# Altium schematic sheet Main.SchDoc
size A3; SheetNumber: 1; SheetTotal: 5
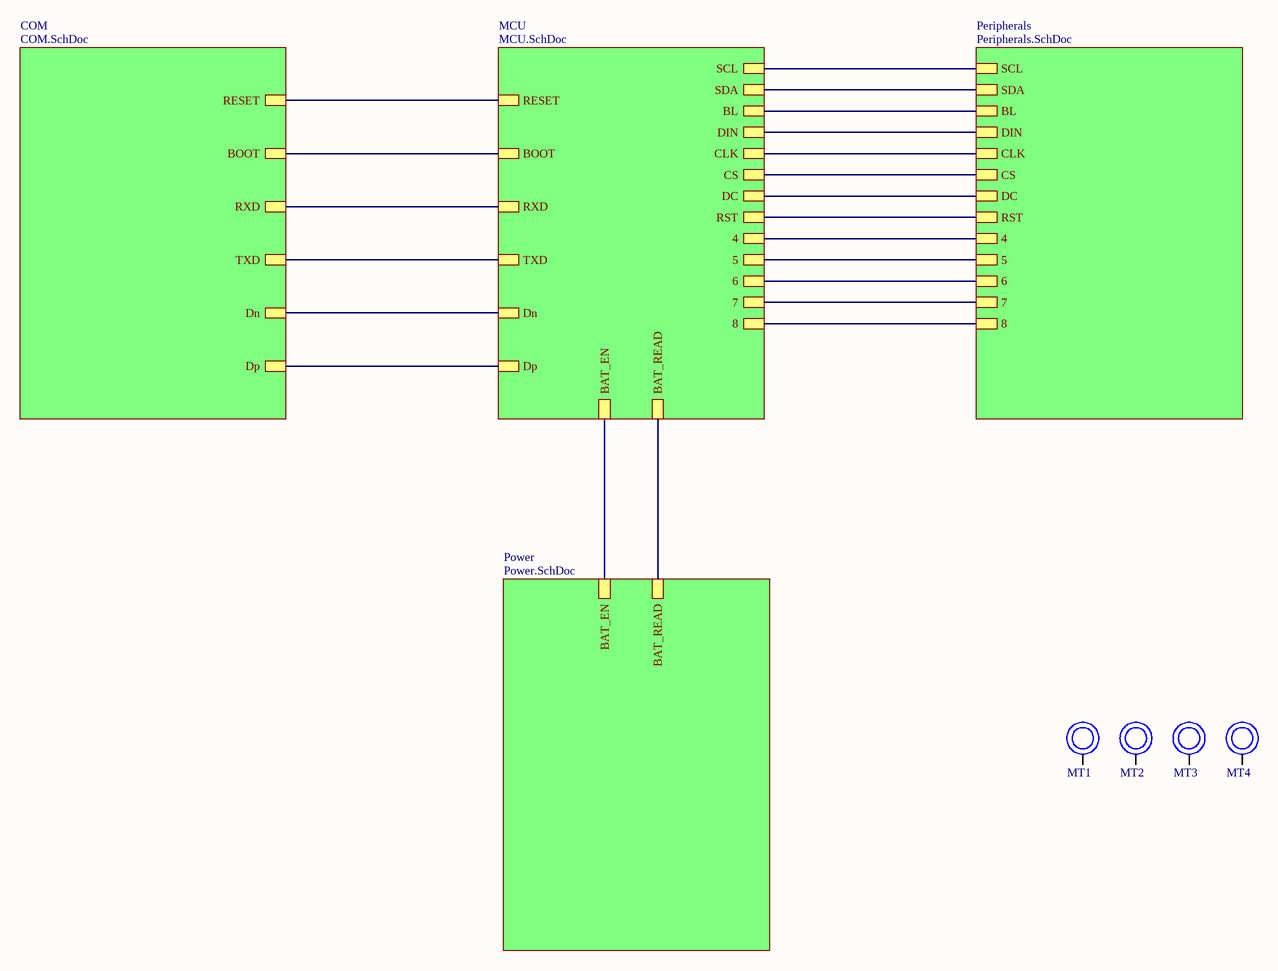
[diagram p0: Main.SchDoc]

## Parts
MT1  Mounting  [Mounting]  (value not drawn)
MT2  Mounting  [Mounting]  (value not drawn)
MT3  Mounting  [Mounting]  (value not drawn)
MT4  Mounting  [Mounting]  (value not drawn)

## Sub-sheets
COM = COM.SchDoc: RXD, TXD, Dn, Dp, BOOT, RESET
MCU = MCU.SchDoc: TXD, RXD, DC, RST, CS, SCL, SDA, BL, DIN, CLK, BAT_EN, BAT_READ, Dn, Dp, 7, 4, 6, 8, 5, RESET, BOOT
Peripherals = Peripherals.SchDoc: SCL, SDA, BL, DIN, CLK, CS, DC, RST, 4, 8, 5, 7, 6
Power = Power.SchDoc: BAT_EN, BAT_READ

## Nets
(unnamed): sheet MCU/TXD, sheet COM/TXD
(unnamed): sheet MCU/RXD, sheet COM/RXD
(unnamed): sheet MCU/DC, sheet Peripherals/DC
(unnamed): sheet MCU/RST, sheet Peripherals/RST
(unnamed): sheet MCU/CS, sheet Peripherals/CS
(unnamed): sheet MCU/SCL, sheet Peripherals/SCL
(unnamed): sheet MCU/SDA, sheet Peripherals/SDA
(unnamed): sheet MCU/BL, sheet Peripherals/BL
(unnamed): sheet MCU/DIN, sheet Peripherals/DIN
(unnamed): sheet MCU/CLK, sheet Peripherals/CLK
(unnamed): sheet MCU/BAT_EN, sheet Power/BAT_EN
(unnamed): sheet MCU/BAT_READ, sheet Power/BAT_READ
(unnamed): sheet MCU/Dn, sheet COM/Dn
(unnamed): sheet MCU/Dp, sheet COM/Dp
(unnamed): sheet MCU/7, sheet Peripherals/7
(unnamed): sheet MCU/4, sheet Peripherals/4
(unnamed): sheet MCU/6, sheet Peripherals/6
(unnamed): sheet MCU/8, sheet Peripherals/8
(unnamed): sheet MCU/5, sheet Peripherals/5
(unnamed): sheet MCU/RESET, sheet COM/RESET
(unnamed): sheet MCU/BOOT, sheet COM/BOOT

Not connected (* = marked no-connect by the designer): MT1 A; MT2 A; MT3 A; MT4 A